# Altium schematic sheet cs301_YourGroupNumber.SchDoc
size A4
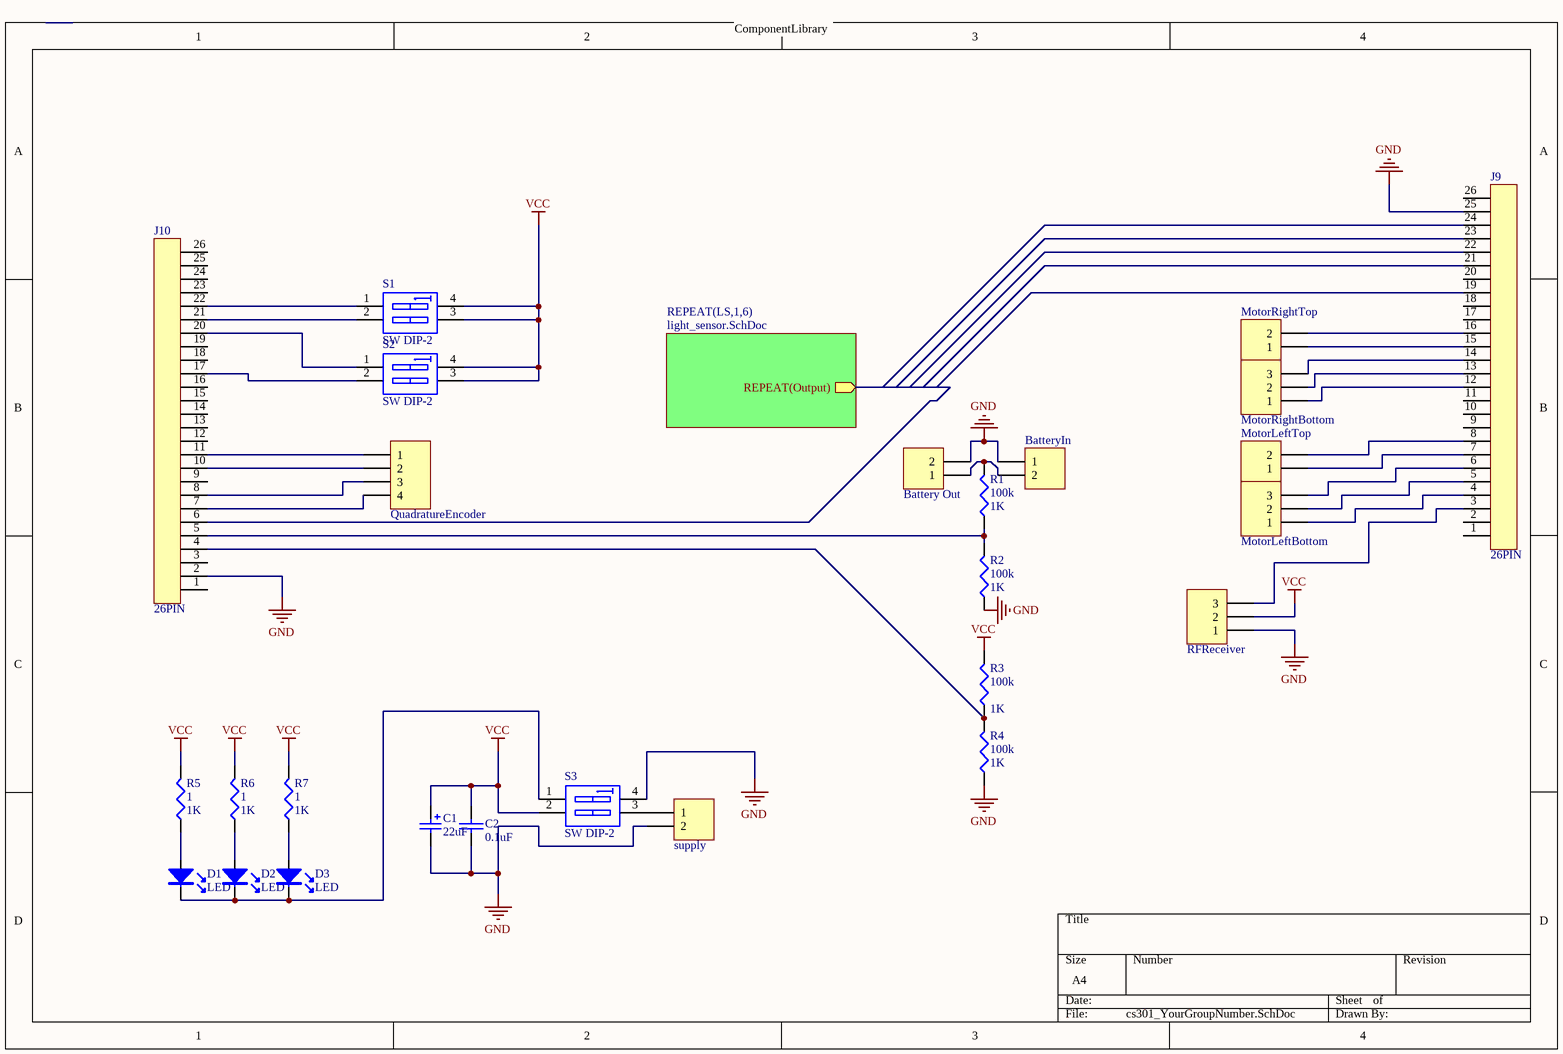
[diagram p0: cs301_YourGroupNumber.SchDoc]

## Parts
Battery_Out  2 Way  [ECE-600102STTH]  (value not drawn)
BatteryIn  2 Way  [ECE-600102STTH]  (value not drawn)
C1  22uF  [ECE-CAPAE6.3X5.4SM]
C2  0.1uF  [ECE-CAPC2012-0805SM]
D1  LED  [LED0.1/5MM]
D2  LED  [LED0.1/5MM]
D3  LED  [LED0.1/5MM]
J9  26PIN  [SIP26]
J10  26PIN  [SIP26]
MotorLeftBottom  3 Way  [ECE-600103STTH]  (value not drawn)
MotorLeftTop  2 Way  [ECE-600102STTH]  (value not drawn)
MotorRightBottom  3 Way  [ECE-600103STTH]  (value not drawn)
MotorRightTop  2 Way  [ECE-600102STTH]  (value not drawn)
QuadratureEncoder  4 Way  [ECE-600104STTH]  (value not drawn)
R1  100k  value 1K  [J1-0603]
R2  100k  value 1K  [J1-0603]
R3  100k  value 1K  [J1-0603]
R4  100k  value 1K  [J1-0603]
R5  1  value 1K  [J1-0603]
R6  1  value 1K  [J1-0603]
R7  1  value 1K  [J1-0603]
RFReceiver  3 Way  [ECE-600103STTH]  (value not drawn)
S1  SW DIP-2  [DIP-4]
S2  SW DIP-2  [DIP-4]
S3  SW DIP-2  [DIP-4]
supply  2 Way  [ECE-600102STTH]  (value not drawn)

## Sub-sheets
REPEAT(LS,1,6) = light_sensor.SchDoc: REPEAT(Output) (out)

## Nets
GND: Battery_Out.2 BatteryIn.1 C1.2 C2.2 J9.25 J10.2 R2.1 R4.1 RFReceiver.1 S3.4(B1) supply.2
VCC: C1.1 C2.1 R3.2 R5.2 R6.2 R7.2 RFReceiver.2 S1.3(B2) S1.4(B1) S2.3(B2) S2.4(B1) S3.2(A2)
NetBattery_Out_1: Battery_Out.1 BatteryIn.2 R1.2
NetD1_A: D1.A R5.1
NetD1_K: D1.K D2.K D3.K S3.1(A1)
NetD2_A: D2.A R6.1
NetD3_A: D3.A R7.1
NetJ9_3: J9.3 RFReceiver.3
NetJ9_4: J9.4 MotorLeftBottom.1
NetJ9_5: J9.5 MotorLeftBottom.2
NetJ9_6: J9.6 MotorLeftBottom.3
NetJ9_7: J9.7 MotorLeftTop.1
NetJ9_8: J9.8 MotorLeftTop.2
NetJ9_12: J9.12 MotorRightBottom.1
NetJ9_13: J9.13 MotorRightBottom.2
NetJ9_14: J9.14 MotorRightBottom.3
NetJ9_15: J9.15 MotorRightTop.1
NetJ9_16: J9.16 MotorRightTop.2
NetJ10_4: J10.4 R3.1 R4.2
NetJ10_5: J10.5 R1.1 R2.2
NetJ10_7: J10.7 QuadratureEncoder.4
NetJ10_8: J10.8 QuadratureEncoder.3
NetJ10_10: J10.10 QuadratureEncoder.2
NetJ10_11: J10.11 QuadratureEncoder.1
NetJ10_17: J10.17 S2.2(A2)
NetJ10_20: J10.20 S2.1(A1)
NetJ10_21: J10.21 S1.2(A2)
NetJ10_22: J10.22 S1.1(A1)
NetS3_3: S3.3(B2) supply.1

Not connected (* = marked no-connect by the designer): J9 1 2 9 10 11 17 18 19 20 21 22 23 24 26; J10 1 3 6 9 12 13 14 15 16 18 19 23 24 25 26

## Notes on the sheet
- ComponentLibrary

## Library data of the parts
Battery_Out BatteryIn MotorLeftTop MotorRightTop supply = CON000001: HEADER POLARISED 2WAY TH; Manufactuer: GTK; Manufacturer-PN: 600102ST; Assembly Method: Through hole; Item Type: Item; Path: ece/ts/Lists/Stock Inventory; UoA Stock#: CON000001; Value: 2 Way; Size/Package: 2.54 Radial; Datasheet Link: http://share.engineering.auckland.ac.nz/ece/ts/Student%20Documents/polarised_connectors.pdf; Supplier1: Elecon; Supplier1-PN: YY3N02; Supplier2: Active Components; Supplier2-PN: 600102ST; Component Type: NA; Category: Connector; Status: Active
C1 = CAP 22uF/35V SM: Polarized Capacitor (Radial); Revision: July-2002: Re-released for DXP Platform.; Value: 22uF
C2 = CAP 0805 SM: Capacitor; Value: *
MotorLeftBottom MotorRightBottom RFReceiver = CON000002: HEADER POLARISED 3WAY TH; Manufactuer: GTK; Manufacturer-PN: 600103ST; Assembly Method: Through hole; Item Type: Item; Path: ece/ts/Lists/Stock Inventory; UoA Stock#: CON000002; Value: 3 Way; Size/Package: 2.54 Radial; Datasheet Link: http://share.engineering.auckland.ac.nz/ece/ts/Student%20Documents/polarised_connectors.pdf; Supplier1: Elecon; Supplier1-PN: YY3N03; Supplier2: Active Components; Supplier2-PN: 600103ST; Component Type: NA; Category: Connector; Status: Active
QuadratureEncoder = CON000003: HEADER POLARISED 4WAY TH; Manufactuer: GTK; Manufacturer-PN: 600104ST; Assembly Method: Through hole; Item Type: Item; Path: ece/ts/Lists/Stock Inventory; UoA Stock#: CON000003; Value: 4 Way; Size/Package: 2.54 Radial; Datasheet Link: http://share.engineering.auckland.ac.nz/ece/ts/Student%20Documents/polarised_connectors.pdf; Supplier1: Elecon; Supplier1-PN: YY3N04; Supplier2: Active Components; Supplier2-PN: 600104ST; Component Type: NA; Category: Connector; Status: Active
R1-R7 = Res3: Resistor; Published: 8-Jun-2000; LatestRevisionDate: 29-May-2009; LatestRevisionNote: IPC-7351 Footprint Added.; PackageReference: J1-0603; Publisher: Altium Limited; PackageDescription: Chip Resistor
S1-S3 = SW DIP-2: DIP Switch, 2 Position, SPST; Published: 24-Mar-1999; LatestRevisionDate: 17-Jul-2002; LatestRevisionNote: Re-released for DXP Platform.; PackageReference: DIP-4; Publisher: Altium Limited